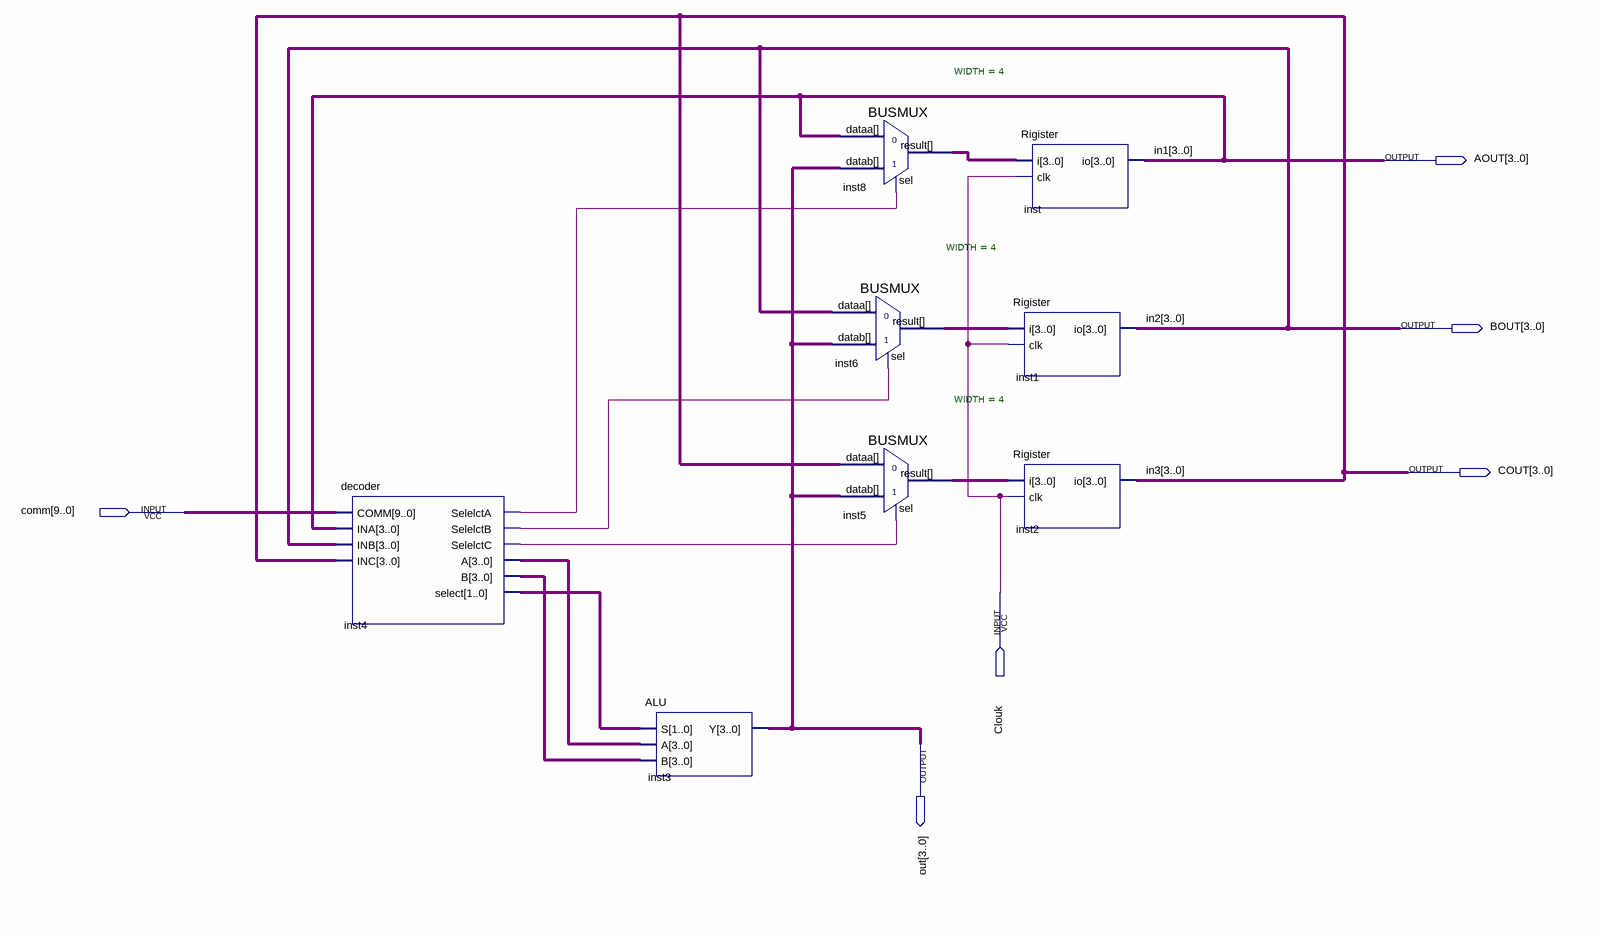
[diagram p0: schematic sheet]
// Quartus schematic EU.bdf as structural Verilog: 8 symbols, 6 pins
module EU (
  input  [9:0] comm,
  input  Clouk,
  output [3:0] AOUT,
  output [3:0] BOUT,
  output [3:0] COUT,
  output [3:0] out
);

  wire inst4_selelcta, inst4_selelctb, inst4_selelctc;
  wire [1:0] inst4_select;
  wire [3:0] inst4_a, inst4_b, inst5_result, inst6_result, inst8_result;

  decoder inst4 (
    .COMM(comm), .INA(AOUT), .INB(BOUT), .INC(COUT), .SelelctA(inst4_selelcta), .SelelctB(inst4_selelctb),
    .SelelctC(inst4_selelctc), .A(inst4_a), .B(inst4_b), .select(inst4_select));
  ALU inst3 (.S(inst4_select), .A(inst4_a), .B(inst4_b), .Y(out));
  BUSMUX #(.WIDTH(4)) inst8 (.datab(out), .sel(inst4_selelcta), .dataa(AOUT), .result(inst8_result));
  BUSMUX #(.WIDTH(4)) inst6 (.datab(out), .sel(inst4_selelctb), .dataa(BOUT), .result(inst6_result));
  BUSMUX #(.WIDTH(4)) inst5 (.datab(out), .sel(inst4_selelctc), .dataa(COUT), .result(inst5_result));
  Rigister inst (.i(inst8_result), .clk(Clouk), .io(AOUT));
  Rigister inst1 (.i(inst6_result), .clk(Clouk), .io(BOUT));
  Rigister inst2 (.i(inst5_result), .clk(Clouk), .io(COUT));

  // Other names for the same wires on the sheet: in1[3:0] = AOUT; in2[3:0] = BOUT; in3[3:0] = COUT
endmodule
